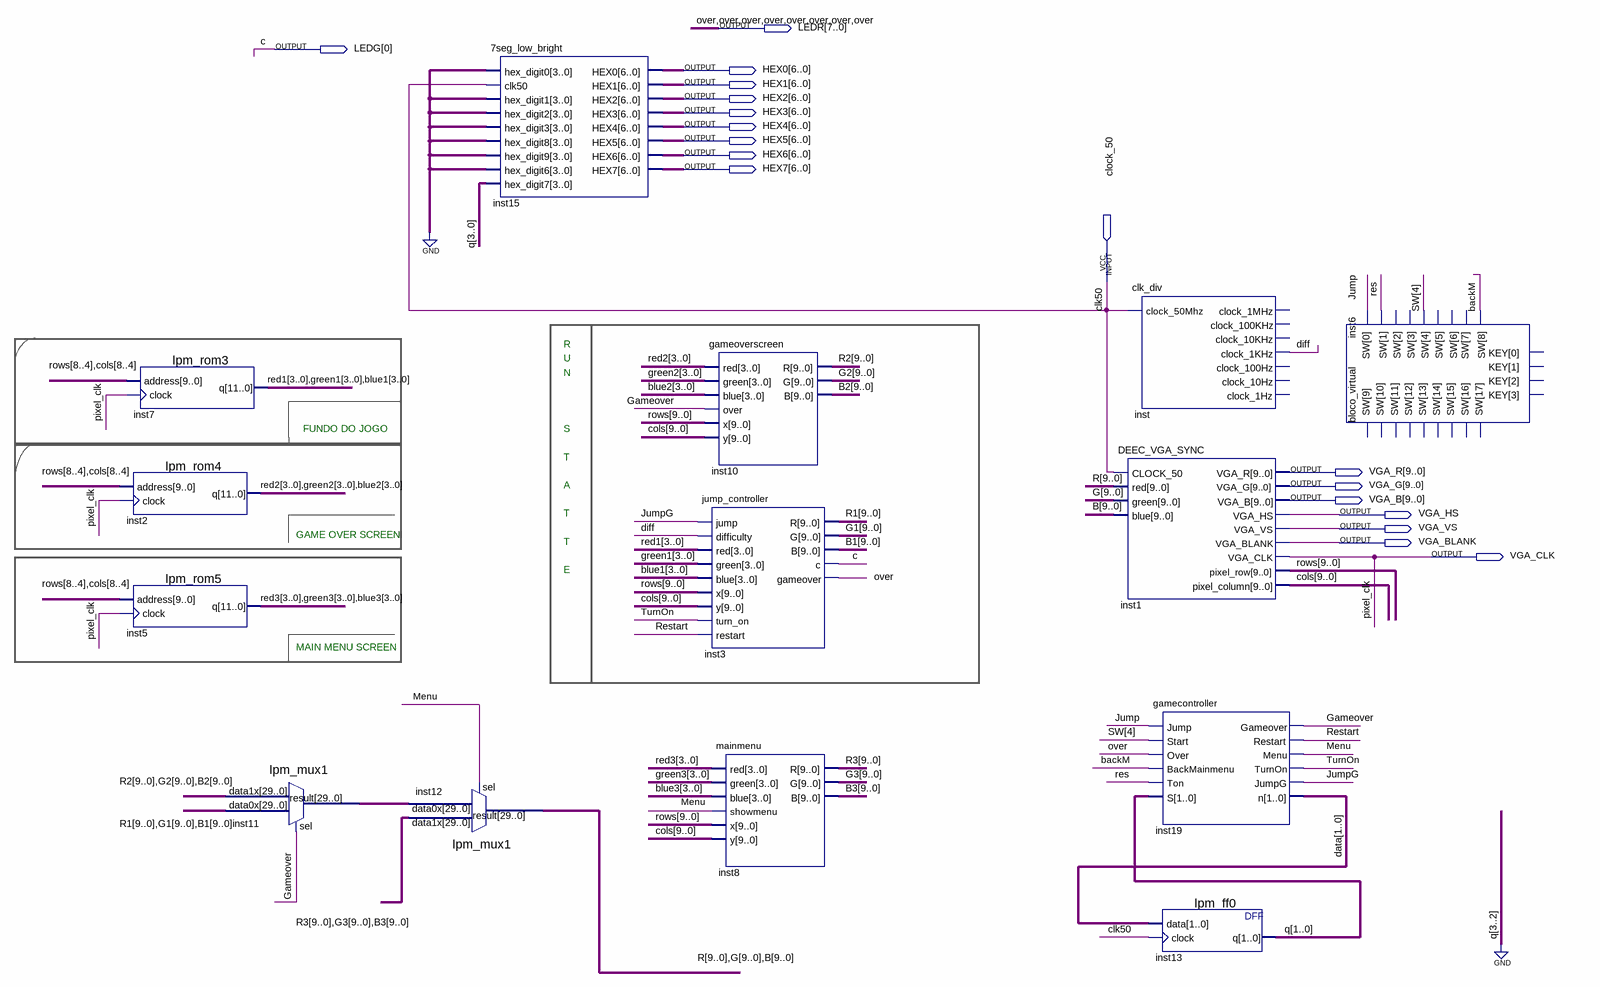
[diagram p0: schematic sheet]
// Quartus schematic projetopsd.bdf as structural Verilog: 14 symbols, 18 pins
module projetopsd (
  input  clock_50,
  output [7:0] LEDR,
  output [0:0] LEDG,
  output [6:0] HEX0,
  output [6:0] HEX1,
  output [6:0] HEX2,
  output [6:0] HEX3,
  output [6:0] HEX4,
  output [6:0] HEX5,
  output [6:0] HEX6,
  output [6:0] HEX7,
  output [9:0] VGA_R,
  output [9:0] VGA_G,
  output [9:0] VGA_B,
  output VGA_HS,
  output VGA_VS,
  output VGA_BLANK,
  output VGA_CLK
);

  wire backM, diff, Gameover, Jump, JumpG, Menu, res, Restart, TurnOn;
  wire [1:0] data, q;
  wire [3:0] blue1, blue2, blue3, green1, green2, green3, red1, red2, red3;
  wire [4:4] SW;
  wire [9:0] B, B1, B2, B3, cols, G, G1, G2, G3, R, R1, R2, R3, rows;
  wire [29:0] inst11_result;
  wire [17:0] inst6_sw_open;  // unused outputs

  lpm_rom3 inst7 (.address({rows[8:4], cols[8:4]}), .clock(VGA_CLK), .q({red1, green1, blue1}));
  lpm_rom4 inst2 (.address({rows[8:4], cols[8:4]}), .clock(VGA_CLK), .q({red2, green2, blue2}));
  lpm_rom5 inst5 (.address({rows[8:4], cols[8:4]}), .clock(VGA_CLK), .q({red3, green3, blue3}));
  lpm_mux1 inst11 (.data1x({R2, G2, B2}), .data0x({R1, G1, B1}), .sel(Gameover), .result(inst11_result));
  lpm_mux1 inst12 (.data1x({R3, G3, B3}), .data0x(inst11_result), .sel(Menu), .result({R, G, B}));
  \7seg_low_bright  inst15 (
    .hex_digit0(4'b0000), .clk50(clock_50), .hex_digit1(4'b0000), .hex_digit2(4'b0000), .hex_digit3(4'b0000),
    .hex_digit8(4'b0000), .hex_digit9(4'b0000), .hex_digit6(4'b0000), .hex_digit7({2'b00, q}), .HEX0(HEX0),
    .HEX1(HEX1), .HEX2(HEX2), .HEX3(HEX3), .HEX4(HEX4), .HEX5(HEX5), .HEX6(HEX6), .HEX7(HEX7));
  gameoverscreen inst10 (
    .red(red2), .green(green2), .blue(blue2), .over(Gameover), .x(rows), .y(cols), .R(R2), .G(G2), .B(B2));
  jump_controller inst3 (
    .jump(JumpG), .difficulty(diff), .red(red1), .green(green1), .blue(blue1), .x(rows), .y(cols),
    .turn_on(TurnOn), .restart(Restart), .R(R1), .G(G1), .B(B1), .c(LEDG[0]), .gameover(LEDR[7]));
  mainmenu inst8 (
    .red(red3), .green(green3), .blue(blue3), .showmenu(Menu), .x(rows), .y(cols), .R(R3), .G(G3), .B(B3));
  clk_div inst (
    .clock_50Mhz(clock_50), .clock_1KHz(diff));  // open: clock_1MHz, clock_100KHz, clock_10KHz, clock_100Hz, clock_10Hz, clock_1Hz
  DEEC_VGA_SYNC inst1 (
    .CLOCK_50(clock_50), .red(R), .green(G), .blue(B), .VGA_R(VGA_R), .VGA_G(VGA_G), .VGA_B(VGA_B),
    .VGA_HS(VGA_HS), .VGA_VS(VGA_VS), .VGA_BLANK(VGA_BLANK), .VGA_CLK(VGA_CLK), .pixel_row(rows),
    .pixel_column(cols));
  gamecontroller inst19 (
    .Jump(Jump), .Start(SW[4]), .Over(LEDR[7]), .BackMainmenu(backM), .Ton(res), .S(q), .Gameover(Gameover),
    .Restart(Restart), .Menu(Menu), .TurnOn(TurnOn), .JumpG(JumpG), .n(data));
  lpm_ff0 inst13 (.data(data), .clock(clock_50), .q(q));
  bloco_virtual inst6 (.SW({inst6_sw_open[17:9], backM, inst6_sw_open[7:5], SW[4], inst6_sw_open[3:2], res, Jump}));  // open: KEY

  assign LEDR[6:0] = {7{LEDR[7]}};

  // Other names for the same wires on the sheet: c = LEDG[0]; clk50 = clock_50; over = LEDR[7]; pixel_clk = VGA_CLK

  // Notes on the sheet:
  //   R
  //   U
  //   N
  //   FUNDO DO JOGO
  //   S
  //   T
  //   A
  //   T
  //   GAME OVER SCREEN
  //   T
  //   E
  //   MAIN MENU SCREEN
endmodule
